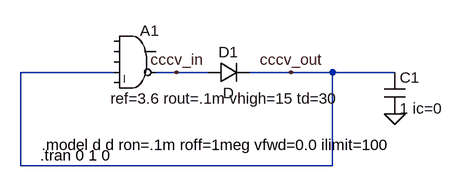
[diagram p0: schematic CC_CV_Source.asc]
CC_CV_Source.asc, the LTspice schematic file:
Version 4
SHEET 1 880 680
WIRE 144 176 0 176
WIRE 240 176 208 176
WIRE 288 176 240 176
WIRE 416 176 352 176
WIRE 480 176 416 176
WIRE 576 176 480 176
WIRE 0 320 0 176
WIRE 480 320 480 176
WIRE 480 320 0 320
FLAG 240 176 cccv_in
FLAG 416 176 cccv_out
FLAG 576 240 0
SYMBOL Digital\\and 176 96 R0
WINDOW 3 -38 120 Left 2
SYMATTR InstName A1
SYMATTR Value ref=3.6 rout=.1m vhigh=15 td=30
SYMBOL diode 288 192 R270
WINDOW 0 32 32 VTop 2
WINDOW 3 0 32 VBottom 2
SYMATTR InstName D1
SYMBOL cap 560 176 R0
SYMATTR InstName C1
SYMATTR Value 1 ic=0
TEXT 32 288 Left 2 !.model d d ron=.1m roff=1meg vfwd=0.0 ilimit=100
TEXT 30 304 Left 2 !.tran 0 1 0

The netlist it stands for:
* CC_CV_Source.asc
A1 0 0 0 cccv_out 0 cccv_in 0 0 AND ref=3.6 rout=.1m vhigh=15 td=30
D1 cccv_in cccv_out D
C1 cccv_out 0 1 ic=0
.model D D
.lib standard.dio
.model d d ron=.1m roff=1meg vfwd=0.0 ilimit=100
.tran 0 1 0
.backanno
.end